# Altium project KourseWork.PrjPcb
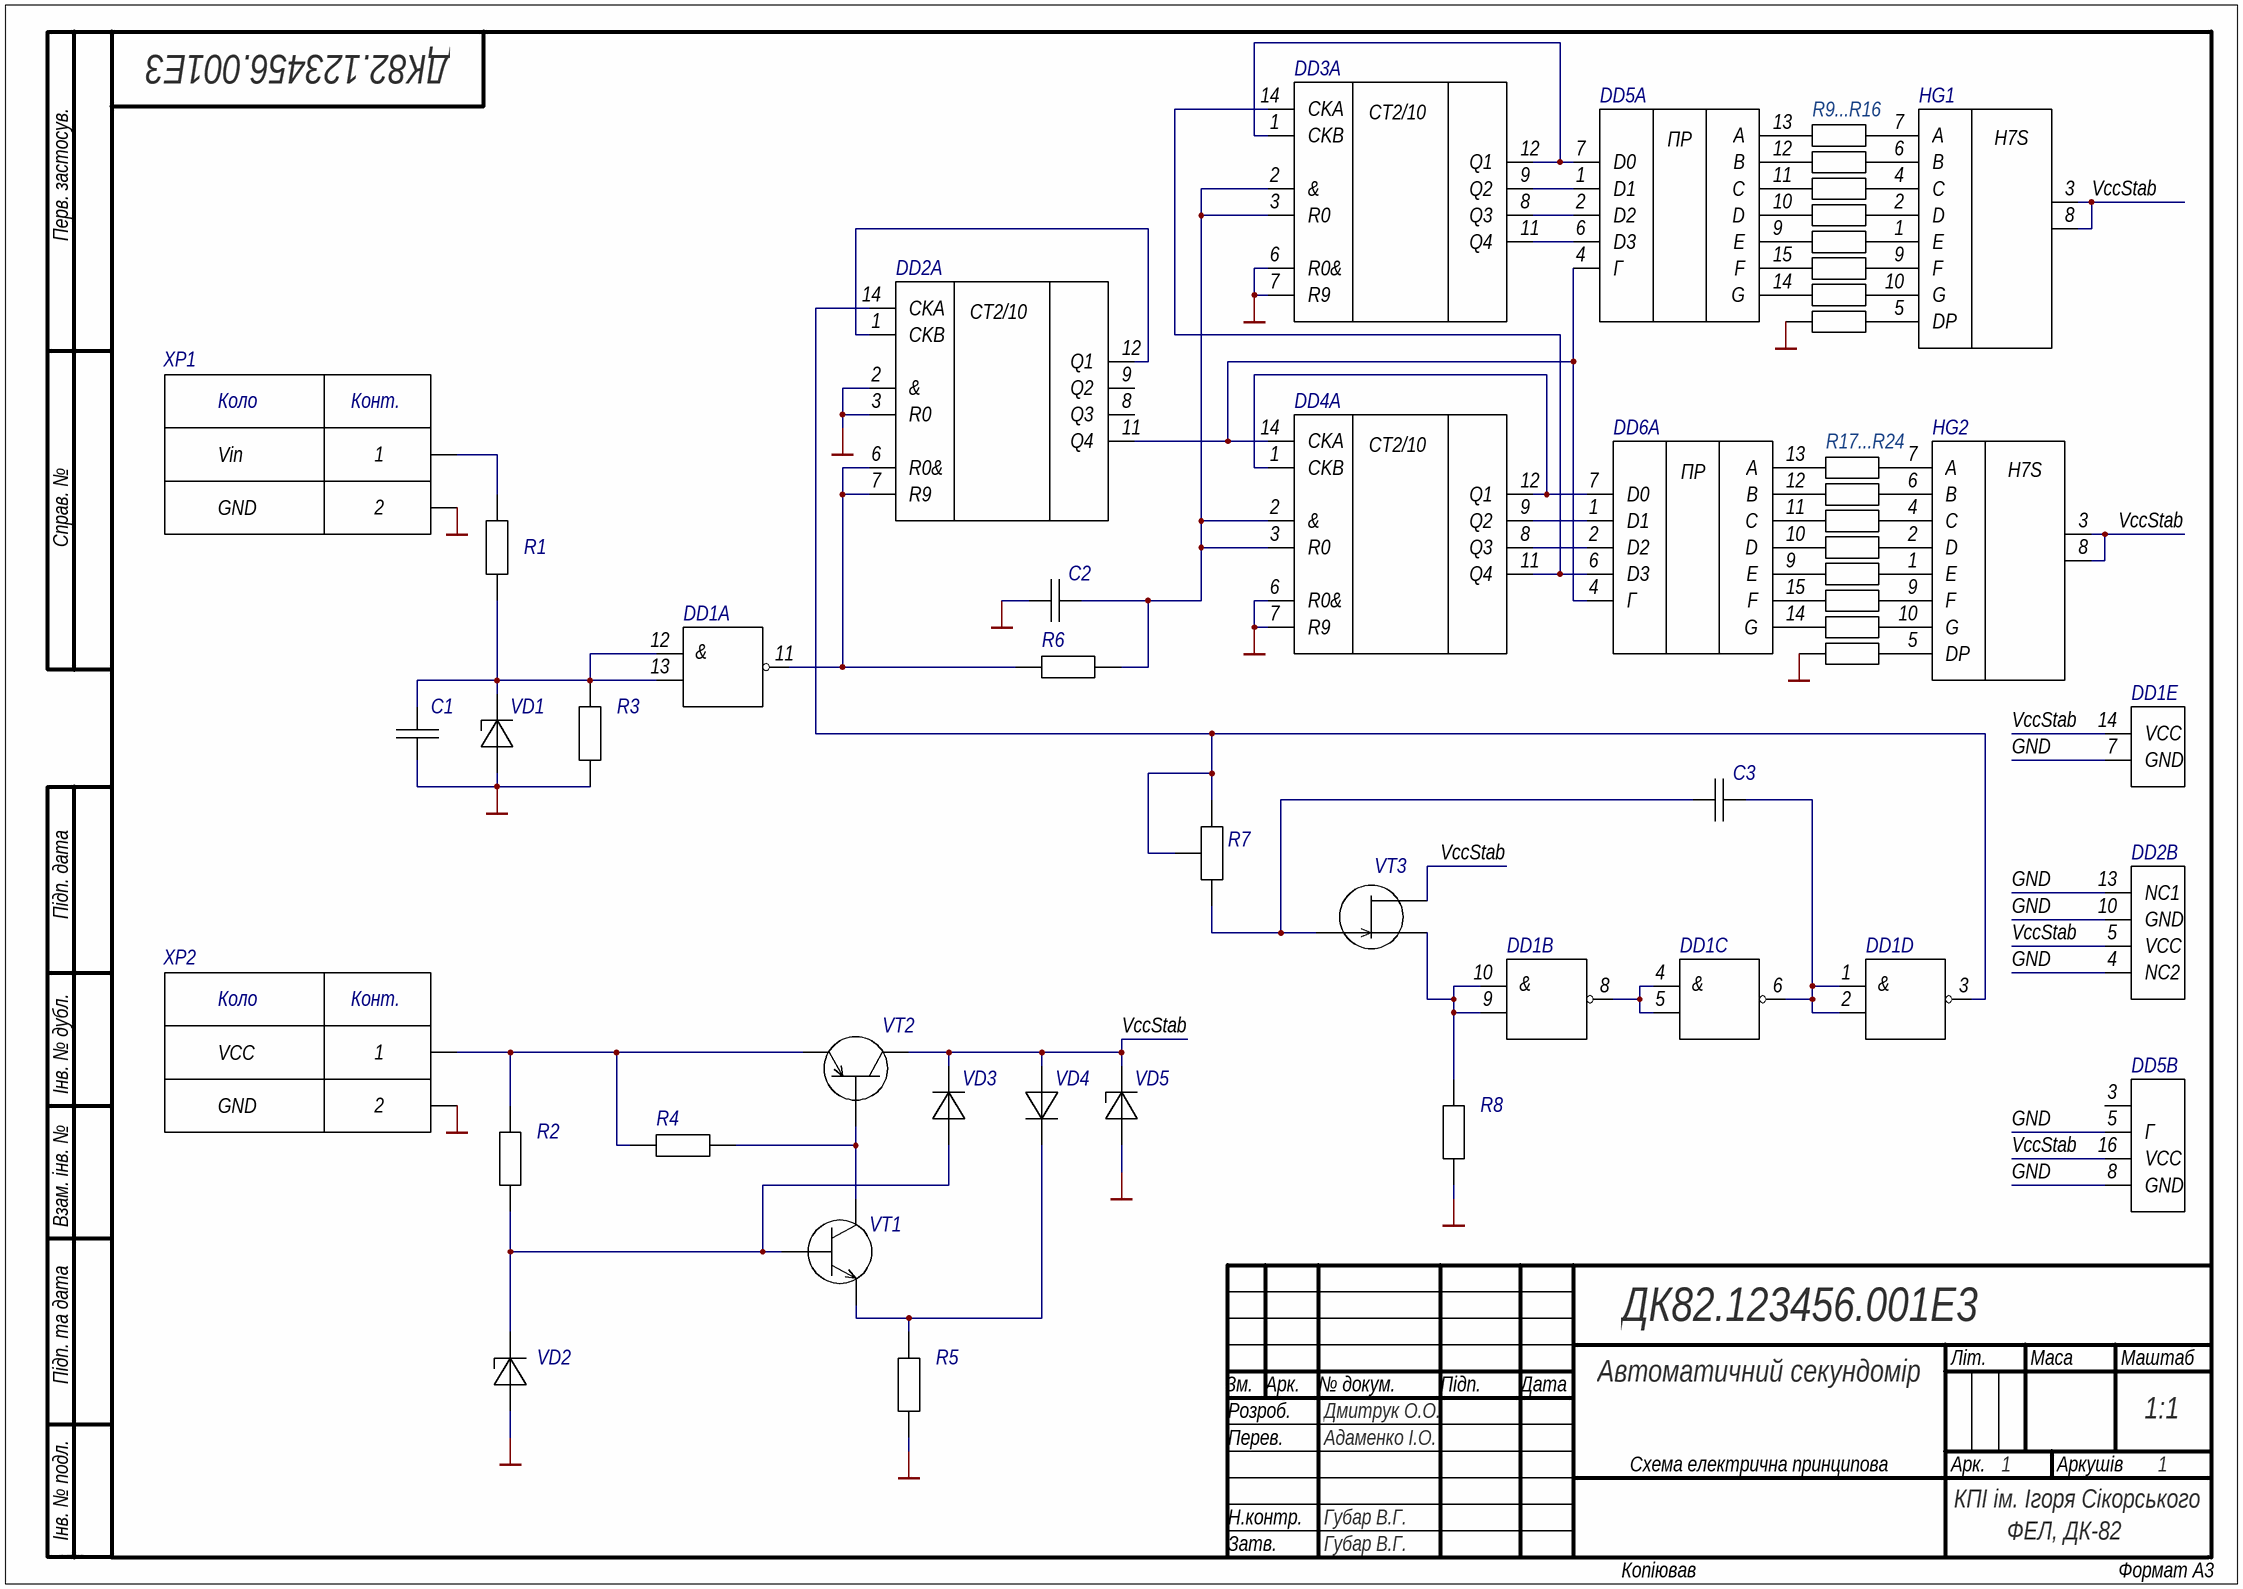
[diagram p0: AutoTimer_List1.SchDoc]
Вид_документа_SCH: Схема електрична принципова; Код_документа_SCH: Е3; Наименование: Автоматичний секундомір; Наименование1: Автоматичний секундомір; Наименование_PCB: Плата друкована; Обозначение: ДК82.123456.001; Обозначение_PCB: ДК82.654321.001; Обозначение_Код: ДК82.123456.001Е3; Проект: ДК82.123456.001; Формат_PCB: А3; п_Н_контр_Р: Губар В.Г.; п_Пров_Р: Адаменко І.О.; п_Разраб_Р: Дмитрук О.О.; п_Утв_Р: Губар В.Г.
1 sheet, 45 parts. Net scope: global (net labels, ports and power ports of the same name join across sheets).
Board file: PCB AutoTimer.PcbDoc

## Sheet AutoTimer_List1.SchDoc
size 420 x 297 mm; Organization: ФЕЛ, ДК-82; DocumentNumber: 1; SheetNumber: 1; SheetTotal: 1

### Parts
C1  С-0805 50 В 4,7 мкФ 10% X7R KEMET  [0805]  (value not drawn)
C2  С-0805 50 В 1 мкФ 10% X7R KEMET  [0805]  (value not drawn)
C3  С-0805 50 В 1 мкФ 10% X7R KEMET  [0805]  (value not drawn)
DD1  SN74LS00 Texas Insturments  [SN74LS00 SN74LS90 FOOTPRINT]  (value not drawn)  (parts A,B,C,D,E of 5)
DD2  SN74LS90 Texas Insturments  [SN74LS00 SN74LS90 FOOTPRINT]  (value not drawn)  (parts A,B of 2)
DD3  SN74LS90 Texas Insturments  [SN74LS00 SN74LS90 FOOTPRINT]  (value not drawn)  (part A of 2)
DD4  SN74LS90 Texas Insturments  [SN74LS00 SN74LS90 FOOTPRINT]  (value not drawn)  (part A of 2)
DD5  К514ПР1 *  [К514ПР1 FOOTPRINT]  (value not drawn)  (parts A,B of 2)
DD6  К514ПР1 *  [К514ПР1 FOOTPRINT]  (value not drawn)  (part A of 2)
HG1  KCSA56-105 Kingbright  [KCSA56-105_FOOTPRINT]  (value not drawn)
HG2  KCSA56-105 Kingbright  [KCSA56-105_FOOTPRINT]  (value not drawn)
R1  R-0805 0,125 Вт 6,2 кОм 5% Yageo  [0805]  (value not drawn)
R2  R-0805 0,125 Вт 3 кОм 5% Yageo  [0805]  (value not drawn)
R3  R-0805 0,125 Вт 2 кОм 5% Yageo  [0805]  (value not drawn)
R4  R-0805 0,125 Вт 510 Ом 5% Yageo  [0805]  (value not drawn)
R5  R-0805 0,125 Вт 390 Ом 5% Yageo  [0805]  (value not drawn)
R6  R-0805 0,125 Вт 1,2 кОм 5% Yageo  [0805]  (value not drawn)
R7  3313J-1 0,125 Вт 10 кОм 20% Mouzer  [R-3313J-1 FOOTPRINT]  (value not drawn)
R8  R-0805 0,125 Вт 300 Ом 5% Yageo  [0805]  (value not drawn)
R9  R-0805 0,125 Вт 240 Ом 5% Yageo  [0805]  (value not drawn)
R10  R-0805 0,125 Вт 240 Ом 5% Yageo  [0805]  (value not drawn)
R11  R-0805 0,125 Вт 240 Ом 5% Yageo  [0805]  (value not drawn)
R12  R-0805 0,125 Вт 240 Ом 5% Yageo  [0805]  (value not drawn)
R13  R-0805 0,125 Вт 240 Ом 5% Yageo  [0805]  (value not drawn)
R14  R-0805 0,125 Вт 240 Ом 5% Yageo  [0805]  (value not drawn)
R15  R-0805 0,125 Вт 240 Ом 5% Yageo  [0805]  (value not drawn)
R16  R-0805 0,125 Вт 240 Ом 5% Yageo  [0805]  (value not drawn)
R17  R-0805 0,125 Вт 240 Ом 5% Yageo  [0805]  (value not drawn)
R18  R-0805 0,125 Вт 240 Ом 5% Yageo  [0805]  (value not drawn)
R19  R-0805 0,125 Вт 240 Ом 5% Yageo  [0805]  (value not drawn)
R20  R-0805 0,125 Вт 240 Ом 5% Yageo  [0805]  (value not drawn)
R21  R-0805 0,125 Вт 240 Ом 5% Yageo  [0805]  (value not drawn)
R22  R-0805 0,125 Вт 240 Ом 5% Yageo  [0805]  (value not drawn)
R23  R-0805 0,125 Вт 240 Ом 5% Yageo  [0805]  (value not drawn)
R24  R-0805 0,125 Вт 240 Ом 5% Yageo  [0805]  (value not drawn)
VD1  1N4624 BSC  [DO-213]  (value not drawn)
VD2  1N4624 BSC  [DO-213]  (value not drawn)
VD3  1N533B MICROSEMI  [T-18]  (value not drawn)
VD4  1N533B MICROSEMI  [T-18]  (value not drawn)
VD5  1N710A MICROCHIP  [DO-35]  (value not drawn)
VT1  BD233 SavantIC  [ТО-126]  (value not drawn)
VT2  2N5887 ETC  [TO66]  (value not drawn)
VT3  2N3458 MOTOROLA  [SOT23]  (value not drawn)
XP1  DS1021 Ningbo Zhenqin Electronic  [PLS-2]  (value not drawn)  (no BOM)
XP2  DS1021 Ningbo Zhenqin Electronic  [PLS-2]  (value not drawn)  (no BOM)

### Nets
GND: C1.1 C2.2 DD1.7(GND) DD2.2(&) DD2.3(R0) DD2.4(NC2) DD2.10(GND) DD2.13(NC1) DD3.6(R0&) DD3.7(R9) DD4.6(R0&) DD4.7(R9) DD5.5(Г) DD5.8(GND) R3.1 R5.1 R8.1 R16.1 R24.1 VD1.1 VD2.1 VD5.1 XP1.2 XP2.2
VccStab: DD1.14(VCC) DD2.5(VCC) DD5.16(VCC) HG1.3 HG1.8 HG2.3 HG2.8 VD3.2 VD4.1 VD5.2 VT2.2 VT3.1(Source)
NetC1_2: C1.2 DD1.12 DD1.13 R1.1 R3.2 VD1.2
NetC2_1: C2.1 DD3.2(&) DD3.3(R0) DD4.2(&) DD4.3(R0) R6.1
NetC3_1: C3.1 R7.1 VT3.3(Gate)
NetC3_2: C3.2 DD1.1 DD1.2 DD1.6
NetDD1_3: DD1.3 DD2.14(CKA) R7.2 R7.3
NetDD1_4: DD1.4 DD1.5 DD1.8
NetDD1_9: DD1.9 DD1.10 R8.2 VT3.2(Drain)
NetDD1_11: DD1.11 DD2.6(R0&) DD2.7(R9) R6.2
NetDD2_1: DD2.1(CKB) DD2.12(Q1)
NetDD2_11: DD2.11(Q4) DD4.14(CKA) DD5.4(Г) DD6.4(Г)
NetDD3_1: DD3.1(CKB) DD3.12(Q1) DD5.7(D0)
NetDD3_8: DD3.8(Q3) DD5.2(D2)
NetDD3_9: DD3.9(Q2) DD5.1(D1)
NetDD3_11: DD3.11(Q4) DD5.6(D3)
NetDD3_14: DD3.14(CKA) DD4.11(Q4) DD6.6(D3)
NetDD4_1: DD4.1(CKB) DD4.12(Q1) DD6.7(D0)
NetDD4_8: DD4.8(Q3) DD6.2(D2)
NetDD4_9: DD4.9(Q2) DD6.1(D1)
NetDD5_9: DD5.9(E) R13.1
NetDD5_10: DD5.10(D) R12.1
NetDD5_11: DD5.11(С) R11.1
NetDD5_12: DD5.12(B) R10.1
NetDD5_13: DD5.13(А) R9.1
NetDD5_14: DD5.14(G) R15.1
NetDD5_15: DD5.15(F) R14.1
NetDD6_9: DD6.9(E) R21.1
NetDD6_10: DD6.10(D) R20.1
NetDD6_11: DD6.11(С) R19.1
NetDD6_12: DD6.12(B) R18.1
NetDD6_13: DD6.13(А) R17.1
NetDD6_14: DD6.14(G) R23.1
NetDD6_15: DD6.15(F) R22.1
NetHG1_1: HG1.1(E) R13.2
NetHG1_2: HG1.2(D) R12.2
NetHG1_4: HG1.4(C) R11.2
NetHG1_5: HG1.5(DP) R16.2
NetHG1_6: HG1.6(B) R10.2
NetHG1_7: HG1.7(A) R9.2
NetHG1_9: HG1.9(F) R14.2
NetHG1_10: HG1.10(G) R15.2
NetHG2_1: HG2.1(E) R21.2
NetHG2_2: HG2.2(D) R20.2
NetHG2_4: HG2.4(C) R19.2
NetHG2_5: HG2.5(DP) R24.2
NetHG2_6: HG2.6(B) R18.2
NetHG2_7: HG2.7(A) R17.2
NetHG2_9: HG2.9(F) R22.2
NetHG2_10: HG2.10(G) R23.2
NetR1_2: R1.2 XP1.1
NetR2_1: R2.1 VD2.2 VD3.1 VT1.3
NetR2_2: R2.2 R4.1 VT2.1 XP2.1
NetR4_2: R4.2 VT1.2 VT2.3
NetR5_2: R5.2 VD4.2 VT1.1

Not connected (* = marked no-connect by the designer): DD2 8(Q3) 9(Q2); DD5 3

### Notes on the sheet
- R9...R16
- Vin
- R17...R24
- GND
- VCC
- Перв. застосув.
- Справ. №
- Підп. дата
- Інв. № дубл.
- Взам. інв. №
- Підп. та дата
- Зм.
- Розроб.
- Арк.
- № докум.
- Підп.
- Дата
- Літ.
- Маса
- Маштаб
- 1:1
- Перев.
- Аркушів
- Інв. № подл.
- Н.контр.
- Затв.
- КПІ ім. Ігоря Сікорського
- ALTIUM GOSTBOM2.0 KEV
- Копіював
- Формат А3
- (in symbol DS1021) Коло; Конт.
- (in symbol KCSA56-105) H7S
- (in symbol SN74LS00, part A) &
- (in symbol SN74LS00, part B) &
- (in symbol SN74LS00, part C) &
- (in symbol SN74LS00, part D) &
- (in symbol SN74LS90, part A) CT2/10
- (in symbol К514ПР1, part A) ПР

### Library data of the parts
C1 = C-0805 4,7мкФ: 0805; Value: 4,7 мкФ; Voltage: 50 В; Package: С-0805; Temp_Coef: X7R; Tolerance: 10%; Manufacturer: KEMET; ComponentLink1Description: New link; ComponentLink1URL: https://electronoff.ua/good/kondensator-keramicheskij-0805-4-7uf-50v-x7r-10-100sht.php
C2 C3 = C-0805 1мкФ: 0805; Value: 1 мкФ; Voltage: 50 В; Package: С-0805; Temp_Coef: X7R; Tolerance: 10%; Manufacturer: KEMET; ComponentLink1Description: New link; ComponentLink1URL: https://electronoff.ua/good/kondensator-keramicheskij-1206-1uf-50v-x7r-10-100sht.php
DD1 = SN74LS00: Manufacturer: Texas Insturments; Name: SN74LS00; ComponentLink1Description: datasheet; ComponentLink1URL: file:///C:/Users/aleks/Downloads/Telegram%20Desktop/sn7400-sp.pdf
DD2-DD4 = SN74LS90: Manufacturer: Texas Insturments; Name: SN74LS90; ComponentLink1Description: datasheet; ComponentLink1URL: file:///C:/Users/aleks/Downloads/Telegram%20Desktop/SN7490AN.pdf
DD5 DD6 = К514ПР1: Manufacturer: *; Name: К514ПР1; ComponentLink1Description: datasheet; ComponentLink1URL: http://ic-info.ru/upload/iblock/20e/514%D0%9F%D0%A01.pdf
HG1 HG2 = KCSA56-105: Manufacturer: Kingbright; Name: KCSA56-105; ComponentLink1Description: datasheet; ComponentLink1URL: http://www.kosmodrom.com.ua/pdf/KCSA56-105.pdf
R1 = R-0805 6,2кОм: Value: 6,2 кОм; Power: 0,125 Вт; Tolerance: 5%; Manufacturer: Yageo; Package: R-0805
R2 = R-0805 3кОм: Value: 3 кОм; Power: 0,125 Вт; Tolerance: 5%; Manufacturer: Yageo; Package: R-0805
R3 = R-0805 2кОм: Value: 2 кОм; Power: 0,125 Вт; Tolerance: 5%; Manufacturer: Yageo; Package: R-0805
R4 = R-0805 510Ом: Value: 510 Ом; Power: 0,125 Вт; Tolerance: 5%; Manufacturer: Yageo; Package: R-0805
R5 = R-0805 390Ом: Value: 390 Ом; Power: 0,125 Вт; Tolerance: 5%; Manufacturer: Yageo; Package: R-0805
R6 = R-0805 1,2кОм: Value: 1,2 кОм; Power: 0,125 Вт; Tolerance: 5%; Manufacturer: Yageo; Package: R-0805
R7 = R-3313J-1 10кОм: Value: 10 кОм; Power: 0,125 Вт; Tolerance: 20%; Manufacturer: Mouzer; Package: 3313J-1; ComponentLink1Description: New link; ComponentLink1URL: https://eu.mouser.com/datasheet/2/54/3313-776425.pdf
R8 = R-0805 300Ом: Value: 300 Ом; Power: 0,125 Вт; Tolerance: 5%; Manufacturer: Yageo; Package: R-0805
R9-R24 = R-0805 240Ом: Value: 240 Ом; Power: 0,125 Вт; Tolerance: 5%; Manufacturer: Yageo; Package: R-0805
VD1 VD2 = 1N4624: DO-213; Name: 1N4624; Manufacturer: BSC; ComponentLink1Description: datasheet; ComponentLink1URL: https://datasheetspdf.com/pdf/969296/CENTRALSEMICONDUCTOR/1N4624/1
VD3 VD4 = 1N533B: T-18; Name: 1N533B; Manufacturer: MICROSEMI; ComponentLink1Description: datasheet; ComponentLink1URL: http://www.datasheetcatalog.com/datasheets_pdf/1/N/5/3/1N5333B.shtml
VD5 = 1N710A: DO-35; Name: 1N710A; Manufacturer: MICROCHIP; ComponentLink1Description: datasheet; ComponentLink1URL: https://datasheetspdf.com/pdf/569488/CentralSemiconductor/1N710A/1
VT1 = BD233: TO-126; Name: BD233; Manufacturer: SavantIC; ComponentLink1Description: datasheet; ComponentLink1URL: https://datasheetspdf.com/pdf-file/641918/SavantIC/BD233/1
VT2 = 2N5887: TO66; Name: 2N5887; Manufacturer: ETC; ComponentLink1Description: datasheet; ComponentLink1URL: https://datasheetspdf.com/datasheet/2N5891.html
VT3 = 2N3458: SOT23; Name: 2N3458; Manufacturer: MOTOROLA; ComponentLink1Description: datasheet; ComponentLink1URL: https://datasheetspdf.com/datasheet/2N3458.html
XP1 XP2 = DS1021: PLS-2_1x2; Manufacturer: Ningbo Zhenqin Electronic; Name: DS1021